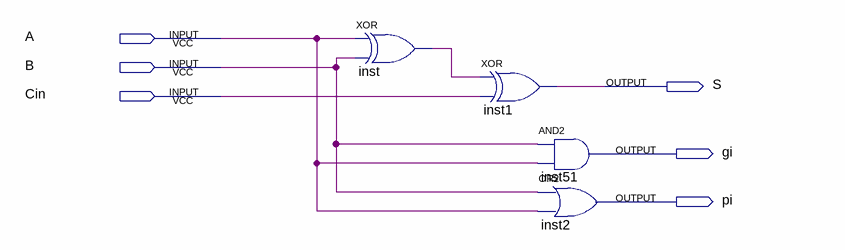
[diagram p0: schematic sheet]
// Quartus schematic 1bit_Full_Adder.bdf as structural Verilog: 4 symbols, 6 pins
module \1bit_Full_Adder  (
  input  A,
  input  B,
  input  Cin,
  output S,
  output gi,
  output pi
);

  wire inst_out;

  xor inst (inst_out, A, B);
  xor inst1 (S, inst_out, Cin);
  and inst51 (gi, B, A);
  or inst2 (pi, B, A);
endmodule
